# EAGLE design 555-dev-2 (EAGLE 7.5.0)
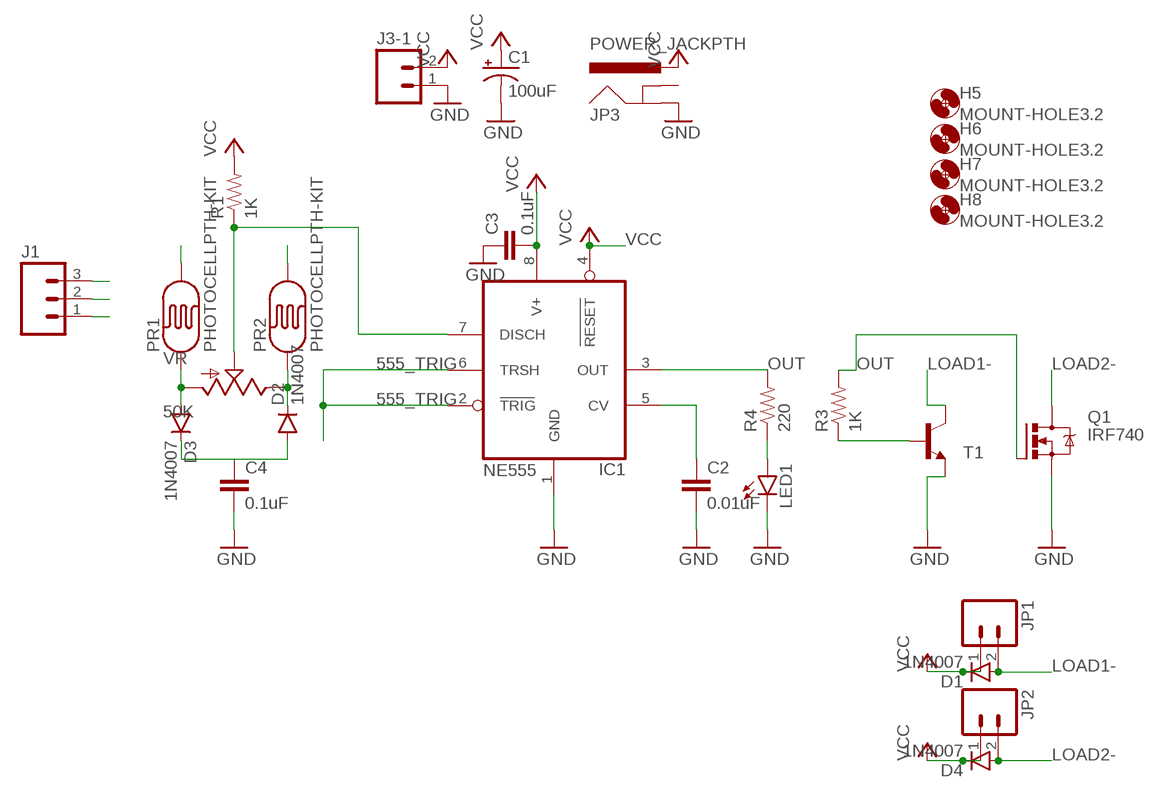
[diagram p0: schematic, sheet 1]

## Parts
C1  100uF  CAP_POLPTH1  [CPOL-RADIAL-100UF-25V]
C2  0.01uF  CAPPTH  [CAP-PTH-SMALL]
C3  0.1uF  CAPPTH  [CAP-PTH-SMALL]
C4  0.1uF  CAPPTH  [CAP-PTH-SMALL]
D1  1N4007  DIODEKIT  [DIODE-1N4148-KIT]
D2  1N4007  DIODEKIT  [DIODE-1N4148-KIT]
D3  1N4007  DIODEKIT  [DIODE-1N4148-KIT]
D4  1N4007  DIODEKIT  [DIODE-1N4148-KIT]
H5  MOUNT-HOLE3.2  [3,2]
H6  MOUNT-HOLE3.2  [3,2]
H7  MOUNT-HOLE3.2  [3,2]
H8  MOUNT-HOLE3.2  [3,2]
IC1  NE555  TLC555  [DIL08]
J1  M03PTH  [1X03]
J3-1  M02PTH  [1X02]
JP1  M023.5MM-NO_SILK  [SCREWTERMINAL-3.5MM-2-NS]
JP2  M023.5MM-NO_SILK  [SCREWTERMINAL-3.5MM-2-NS]
JP3  POWER_JACKPTH  [POWER_JACK_PTH]
LED1  LED5MM-KIT  [LED5MM-KIT]
PR1  PHOTOCELLPTH-KIT  [PHOTOCELL-KIT]
PR2  PHOTOCELLPTH-KIT  [PHOTOCELL-KIT]
Q1  IRF740  [TO220BV]
R1  1K  RESISTORPTH-1/4W  [AXIAL-0.4]
R3  1K  RESISTORPTH-1/4W  [AXIAL-0.4]
R4  220  RESISTORPTH-1/4W  [AXIAL-0.4]
T1  2N2222  [TO92-EBC-OVAL]
VR  50K  POTALPS-KIT  [ALPS_POT_KIT]

## Nets
555_DISCH: IC1.7(DISCH) J1.2 R1.P$1 VR.P$2(S)
555_TRIG: IC1.2(TRIG) IC1.6(TRSH)
GND: C1.2(-) C2.2 C3.1 C4.2 IC1.1(GND) J3-1.1 JP3.GND LED1.K(C) Q1.S T1.E
LOAD1-: D1.A JP1.2 T1.C
LOAD2-: D4.A JP2.2 Q1.D
N$2: D2.C PR2.1 VR.P$1(E)
N$3: D3.A PR1.1 VR.P$3(A)
N$4: C4.1 D2.A D3.C
N$5: C2.1 IC1.5(CV)
N$7: R3.P$1 T1.B
N$9: LED1.A R4.P$1
OUT: IC1.3(OUT) Q1.G R3.P$2 R4.P$2
PR1: J1.1 PR1.2
PR2: J1.3 PR2.2
VCC: C1.1(+) C3.2 D1.C D4.C IC1.4(RESET) IC1.8(V+) J3-1.2 JP1.1 JP2.1 JP3.PWR R1.P$2
Unconnected: JP3.GNDBREAK

## Library data of the parts
C1 = SparkFun-Capacitors:CAP_POL: Capacitor Polarized These are standard SMD and PTH capacitors. Normally 10uF, 47uF, and 100uF in electrolytic and tantalum varieties. Always verify the external diameter of the through hole cap, it varies with capacity, voltage, and manufacturer. The EIA devices should be standard.
C2-C4 = SparkFun-Passives:CAP: Capacitor Standard 0603 ceramic capacitor, and 0.1" leaded capacitor.
D1-D4 = SparkFun-DiscreteSemi:DIODE: Diode These are standard reverse protection diodes and small signal diodes. SMA package can handle up to about 1A. SOD-323 can handle about 200mA. What the SOD-323 package when ordering, there are some mfgs out there that are 5-pin packages.
H5-H8 = holes:MOUNT-HOLE: MOUNTING HOLE with drill center marker
IC1 = SUC:TLC555: TIMER
J1 = SparkFun-Connectors:M03: Header 3 Standard 3-pin 0.1" header. Use with straight break away headers (SKU : PRT-00116), right angle break away headers (PRT-00553), swiss pins (PRT-00743), machine pins (PRT-00117), and female headers (PRT-00115). Molex polarized connector foot print use with SKU : PRT-08232 with associated crimp pins and housings.
J3-1 = SparkFun-Connectors:M02: Standard 2-pin 0.1" header. Use with - straight break away headers ( PRT-00116) - right angle break away headers (PRT-00553) - swiss pins (PRT-00743) - machine pins (PRT-00117) - female headers (PRT-00115) Molex polarized connector foot print use with: PRT-08233 with associated crimp pins and housings. 2.54_SCREWTERM for use with PRT-10571. 3.5mm Screw Terminal footprints for PRT-08084 5mm Screw Terminal footprints for use with PRT-08432
JP1 JP2 = SparkFun-Connectors:M02: Standard 2-pin 0.1" header. Use with - straight break away headers ( PRT-00116) - right angle break away headers (PRT-00553) - swiss pins (PRT-00743) - machine pins (PRT-00117) - female headers (PRT-00115) Molex polarized connector foot print use with: PRT-08233 with associated crimp pins and housings. 2.54_SCREWTERM for use with PRT-10571. 3.5mm Screw Terminal footprints for PRT-08084 5mm Screw Terminal footprints for use with PRT-08432; PROD_ID: CONN-08399
JP3 = SparkFun-Connectors:POWER_JACK: Power Jack This is the standard 5.5mm barrel jack for power. The PTH is the most common, proven, reliable, footprint. The Slot footprint only works if the mill layer is transmitted to the PCB fab house so be warned. Mating wall wart : TOL-00298 (and others); PROD_ID: CONN-08197
LED1 = SparkFun-LED:LED: LEDs Standard schematic elements and footprints for 5mm, 3mm, 1206, and 0603 sized LEDs. 5mm - Spark Fun Electronics SKU : COM-00529 (and others)
PR1 PR2 = SparkFun-Sensors:PHOTOCELL: CdS photoresistor. This is a low cost way to detect light levels. Resistance decreases with more incoming light. SparkFun SKU: SEN-09088
Q1 = transistor-power:IRF740: N-CHANNEL MOS FET
R1 R3 R4 = SparkFun-Resistors:RESISTOR: Resistor Basic schematic elements and footprints for 0603, 1206, and PTH resistors.
T1 = adafruit:2N2222: NPN TRANSISTOR Big oval pads
VR = SparkFun-Electromechanical:POT; PROD_ID: RES-09177

## Board
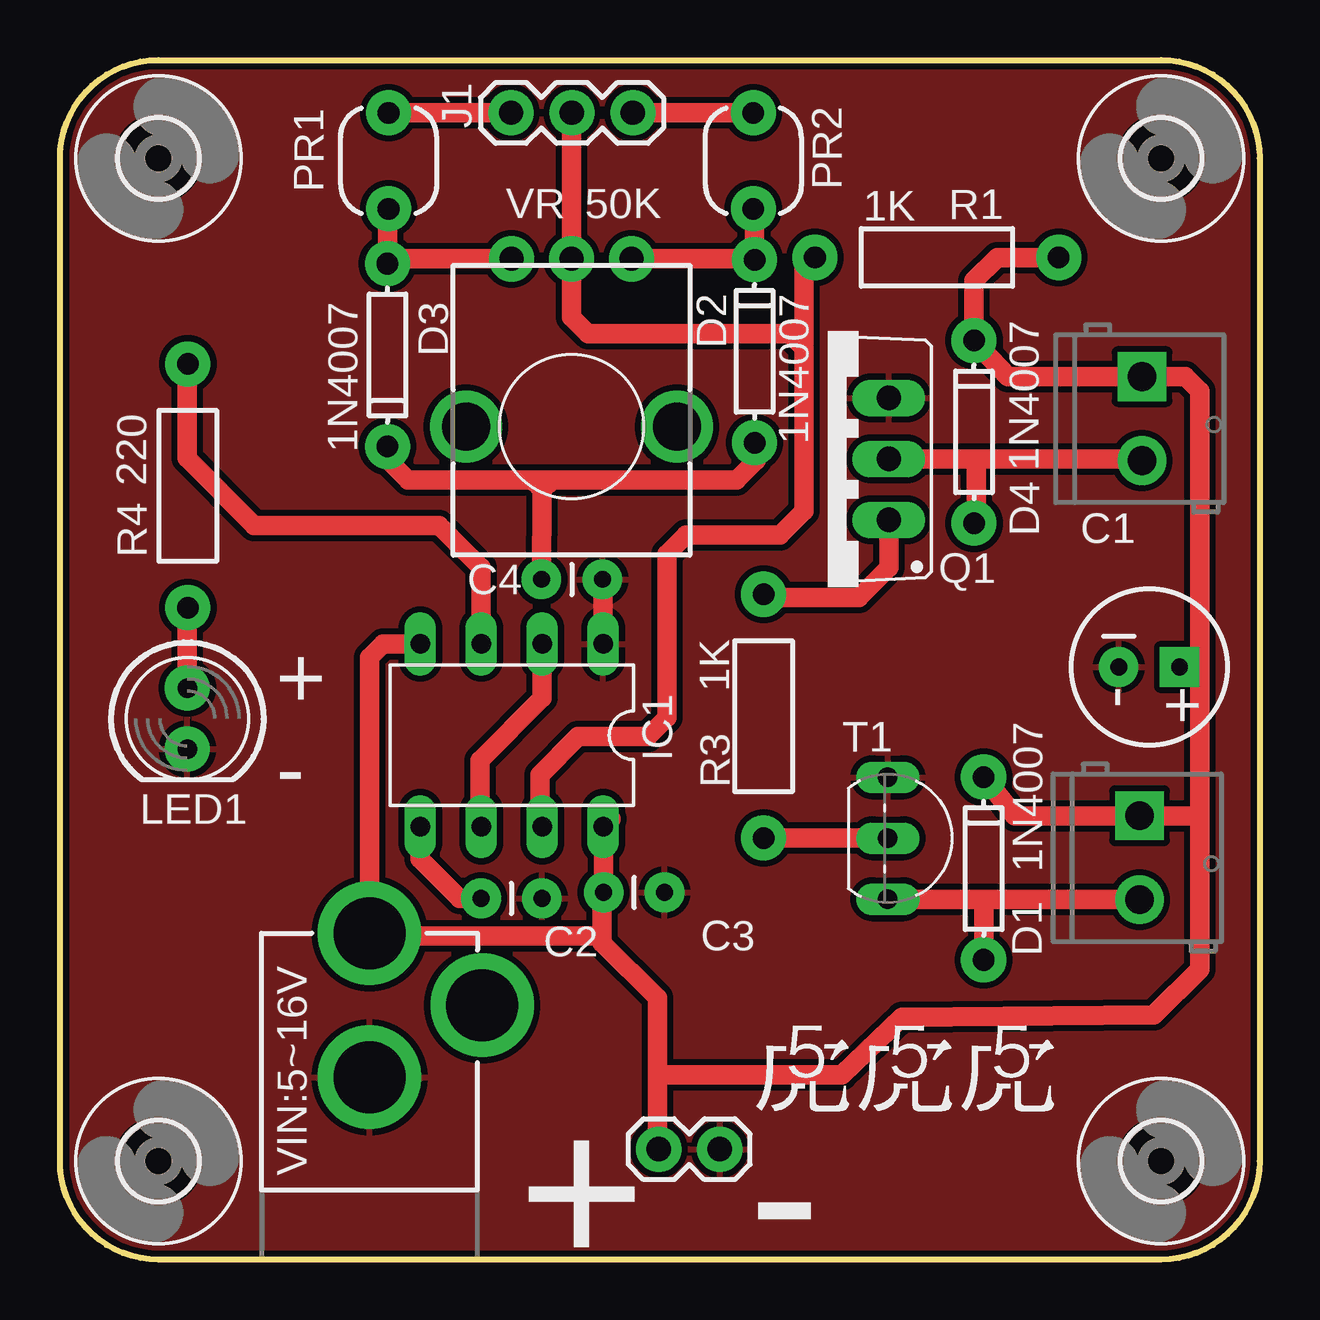
[diagram p1: board, top side]
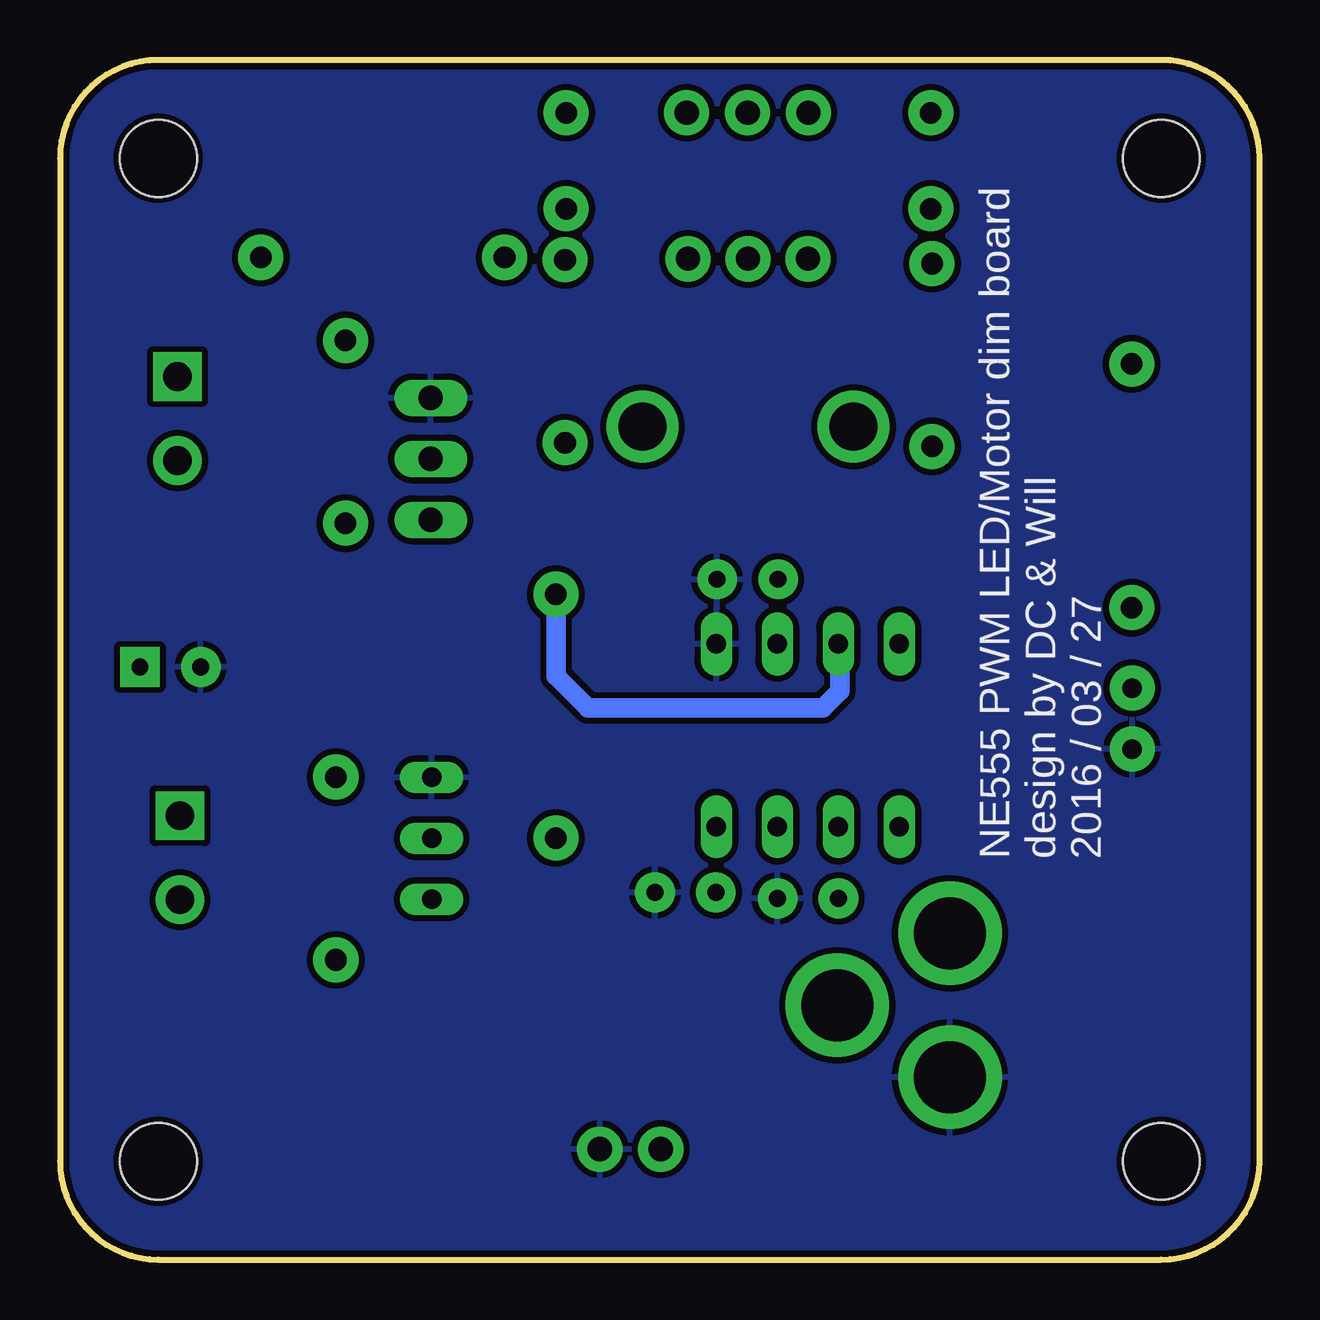
[diagram p2: board, bottom side, seen from below]

Size 50 x 50 mm. Coordinates in mm from the lower left corner, seen from the top.
Outline: 0,4.1 0,45.9 arc-90 4.1,50 45.9,50 arc-90 50,45.9 50,4.1 arc-90 45.9,0 4.1,0 arc-90 0,4.1
Copper layers (1*16): Top 0.035mm / dielectric 1.5mm / Bottom 0.035mm
Design rules "SeeedStudio_2layer_DRU_no_angle_20140221": minimum track width 6mil, minimum drill 12mil, track to track 6mil, track to pad 6mil, pad to pad 6mil, via to via 6mil, smd to smd 0mil, copper to edge 10mil, drill to drill 10mil, minimum pad ring 10mil, minimum via ring 6mil, stop-mask expansion 2mil, vias tented up to drill 100mil, thermal gap 10mil

### Footprints (pad centres in the part's own frame; a part is rotated, then mirrored left to right if it is on the bottom)
CPOL-RADIAL-100UF-25V = drill 0.7 pad 1.651 square: 1 1.27,0 | drill 0.7 pad 1.651: 2 -1.27,0
CAP-PTH-SMALL = drill 0.7 pad 1.651: 1 0,0; 2 2.54,0
DIODE-1N4148-KIT = drill 0.9 pad 1.88: A -3.81,0; C 3.81,0
3,2 = hole 3.2: 0,0
DIL08 = drill 0.813 long: 1 -3.81,-3.81; 2 -1.27,-3.81; 3 1.27,-3.81; 4 3.81,-3.81; 5 3.81,3.81; 6 1.27,3.81; 7 -1.27,3.81; 8 -3.81,3.81
1X03 = drill 1.016 pad 1.88: 1 0,0; 2 2.54,0; 3 5.08,0
1X02 = drill 1.016 pad 1.88: 1 0,0; 2 2.54,0
SCREWTERMINAL-3.5MM-2-NS = drill 1.2 pad 2.032 square: 1 0,0 | drill 1.2 pad 2.032: 2 3.5,0
POWER_JACK_PTH = drill 2.997 pad 4.318: GND 0,7.7; GNDBREAK 4.7,10.7; PWR 0,13.7
LED5MM-KIT = drill 0.813 pad 1.88: A -1.27,0; K 1.27,0
PHOTOCELL-KIT = drill 0.9 pad 1.88: 1 -2,0; 2 2,0
TO220BV = drill 1.016 long: D 0,-2.54; G -2.54,-2.54; S 2.54,-2.54
AXIAL-0.4 = drill 0.9 pad 1.88: P$1 -5.08,0; P$2 5.08,0
TO92-EBC-OVAL = drill 0.813 long: B 0,-1.27; C 2.54,-1.27; E -2.54,-1.27
ALPS_POT_KIT = drill 1 pad 1.88: P$1 7,-2.5; P$2 7,0; P$3 7,2.5 | drill 2: P$4 0,-4.4; P$5 0,4.4

### Placement (x,y rotation side)
C1  45.4,24.7 0 top
C2  17.55,15.05 0 top
C3  25.2,15.3 180 top
C4  20.07,28.35 0 top
D1  38.5,16.3 90 top
D2  28.95,37.86 90 top
D3  13.65,37.7 270 top
D4  38.1,34.5 90 top
H5  4.1,4.1 0 top
H6  45.9,4.1 0 top
H7  4.1,45.9 0 top
H8  45.9,45.9 0 top
IC1  18.83,21.85 180 top
J1  18.8,47.8 0 top
J3-1  27.5,4.6 180 top
JP1  45,18.5 270 top
JP2  45.1,36.8 270 top
JP3  12.9,-0.1 0 top
LED1  5.31,22.55 270 top
PR1  13.7,45.8 90 top
PR2  28.9,45.8 90 top
Q1  32.01,33.37 90 top
R1  36.55,41.77 0 top
R3  29.33,22.65 90 top
R4  5.33,32.25 90 top
T1  35.78,17.56 270 top
U$1  LOGO  [LOGO]  28.8,6 0 top
VR  21.32,34.71 90 top

### Tracks (layer width: path | path; a pad name or v marks a point on that pad's centre or on a via)
555_DISCH
  Top 0.813: J1.2 21.32,47.78 VR.P$2 21.32,39.28 22,38.6 30.4,38.6 | IC1.7 20,18.14 20,20.2 21.6,21.8 24.5,21.8 25.3,22.6 25.3,29.4 26.1,30.2 30,30.2 31,31.2 31,38 30.4,38.6 | R1.P$1 31,41.3 31,39 | 31,38.2 31,39 | 31,39 30.6,38.6 30.4,38.6
555_TRIG
  Top 0.813: 20.07,25.66 IC1.2 20.1,23.4 17.5,20.8 17.5,18.1 IC1.6
GND
  Top 0.813: IC1.1 22.64,28.32 C4.2
  pour Bottom (isolate 0.254): -3.7,50.9 54,50.9 54,-0.6 -3.7,-0.6
  pour Top (isolate 0.254): -3.6,50.9 51.3,50.9 51.3,-0.7 -3.6,-0.7
LOAD1-
  Top 0.813: T1.C 38.5,15.02 | 38.5,15.02 45,15.02 JP1.2 | D1.A 38.5,15.02
LOAD2-
  Top 0.813: Q1.D 38.2,33.37 | 38.2,33.37 45.03,33.37 arc-90 JP2.2 | D4.A arc90 38.2,30.79 38.2,33.37
N$2
  Top 0.813: VR.P$1 28.91,41.71 D2.C 28.95,44.05 PR2.1
N$3
  Top 0.813: VR.P$3 13.85,41.71 D3.A 13.65,43.75 PR1.1
N$4
  Top 0.813: D3.C 13.65,33.35 14.5,32.5 20,32.5 | 20,32.5 20.14,32.5 | 20.5,32.5 28.2,32.5 29,33.3 29,34 D2.A | C4.1 20.1,32 20.1,32.1 | 19.6,32.5 19.8,32.4 20.1,32.1 | 20.1,32.1 20.5,32.5 | 20.5,32.5 20.14,32.5 | 20.14,32.5 20.07,32.43 20,32.5
N$5
  Top 0.813: C2.1 16.65,15.05 15,16.7 15,18.02 IC1.5
N$7
  Top 0.813: R3.P$1 T1.B
N$9
  Top 0.813: R4.P$1 5.43,27.67 5.3,26.8 LED1.A
OUT
  Top 0.813: IC1.3 17.56,28.84 15.8,30.6 8.1,30.6 5.3,33.4 5.3,37.3 R4.P$2 | Q1.G 34.55,28.85 33.3,27.6 29.46,27.6 R3.P$2
  Bottom 0.813: R3.P$2 29.33,24.33 28,23 18.2,23 17.5,23.7 17.5,25.6 IC1.3
PR1
  Top 0.813: J1.1 PR1.2
PR2
  Top 0.813: J1.3 PR2.2
VCC
  Top 0.813: 22.66,18.02 C3.2 22.6,15.24 22.6,13.5 | 22.66,18.02 IC1.8 22.96,18.36 | 24.9,7.7 24.9,4.66 J3-1.2 | 24.9,7.7 24.9,10.9 22.6,13.2 22.6,13.5 | 24.9,7.7 32.6,7.7 35.1,10.1 45.6,10.2 47.5,12.1 47.5,18.6 | 47.5,18.6 47.5,24.4 | 47.5,24.4 47.5,36.2 46.9,36.8 JP2.1 39.51,36.8 D4.C 38.1,40.8 39.07,41.77 R1.P$2 | C1.1 47.2,24.7 47.5,24.4 | 47.5,18.6 47.4,18.5 JP1.1 39.81,18.5 D1.C | 22.66,18.02 22.66,18.56 | 22.6,13.5 13,13.5 JP3.PWR 12.9,25.1 13.46,25.66 IC1.4

### Text on the board
tPlace: - / + | + / - | VIN:5~16V | + | -
bPlace: NE555 PWM LED/Motor dim board / design by DC & Will / 2016 / 03 / 27